# Altium schematic sheet power_supply.SchDoc
size A
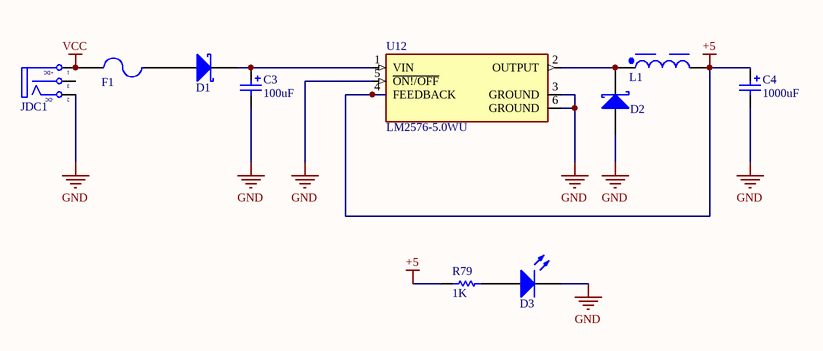
[diagram p0: power_supply.SchDoc]

## Parts
C3  100uF  [WCAP-ATG8_D8H11.5]
C4  1000uF  [WCAP-ATG8_D8H16]
D1  D Schottky  [SS34]  (value not drawn)
D2  D Schottky  [SS34]  (value not drawn)
D3  LED SMD  [LED_0603_Blue]  (value not drawn)
F1  Fuse  [FUSE SMD]  (value not drawn)
JDC1  Jack DC  [DC-IN]  (value not drawn)
L1  100µH, 0.57A  [WE-PD2_5848]  (value not drawn)
R79  value 1K  [RES-SM-0603]  (hidden comment: RESISTOR SMD)
U12  LM2576-5.0WU  [DPAK6P170_1524X459L254X81N]

## Nets
+5: C4.1(P) L1.2 R79.1 U12.4(FEEDBACK)
GND: C3.2(N) C4.2(N) D2.1(A) D3.2(K) JDC1.2(TN) U12.3(GROUND) U12.5(~{ON!/OFF}) U12.6(GROUND)
VCC: F1.1 JDC1.1(T)
NetC3_1: C3.1(P) D1.2(K) U12.1(VIN)
NetD1_1: D1.1(A) F1.2
NetD2_2: D2.2(K) L1.1 U12.2(OUTPUT)
NetD3_1: D3.1(A) R79.2

Not connected (* = marked no-connect by the designer): JDC1 3(S)

## Notes on the sheet
- (in symbol Jack DC) +DC; -DC

## Library data of the parts
C3 = 860010674014: WCAP-ATG8 Aluminum Electrolytic Capacitor, Radial THT, D8xH11.5mm, 100uF, 50V; Manufacturer: Wurth Elektronik; Capacitance Tolerance: +/-20%; Dissipation Factor: 10%; Endurance: 2000h; Leakage Current: 50uA; Ripple Current: 286mA; Technical Reference: ATBE115101M050DSPA7B000; ComponentLink1Description: Manufacturer Link; ComponentLink1URL: https://www.we-online.com/redexpert/article/860010674014?ad; ComponentLink2Description: Datasheet; ComponentLink2URL: https://www.we-online.com/redexpert/spec/860010674014?ad; Category: Aluminum Electrolytic Capacitors; Match Code: WCAP-ATG8; Manufacturer Part Number: 860010674014; Mount: Through Hole; Operating Temperature Max: 85°C; Operating Temperature Min: -40°C; Packaging: Ammo Pack; Height: 11.5mm; Diameter: 8mm; Capacitance: 100uF; Rated Voltage (DC): 50V
C4 = 860010274015: WCAP-ATG8 Aluminum Electrolytic Capacitor, Radial THT, D8xH16mm, 1000uF, 10V; Manufacturer: Wurth Elektronik; Capacitance Tolerance: +/-20%; Dissipation Factor: 19%; Endurance: 2000h; Leakage Current: 100uA; Ripple Current: 725mA; Technical Reference: ATBE160102M010DSPA7B000; ComponentLink1Description: Manufacturer Link; ComponentLink1URL: https://www.we-online.com/redexpert/article/860010274015?ad; ComponentLink2Description: Datasheet; ComponentLink2URL: https://www.we-online.com/redexpert/spec/860010274015?ad; Category: Aluminum Electrolytic Capacitors; Match Code: WCAP-ATG8; Manufacturer Part Number: 860010274015; Mount: Through Hole; Operating Temperature Max: 85°C; Operating Temperature Min: -40°C; Packaging: Ammo Pack; Height: 16mm; Diameter: 8mm; Capacitance: 1000uF; Rated Voltage (DC): 10V
D1 D2 = D Schottky: Schottky Diode; Published: 8-Jun-2000; LatestRevisionDate: 17-Jul-2002; LatestRevisionNote: Re-released for DXP Platform.; PackageReference: SMB; Publisher: Altium Limited; PackageDescription: DO-214-AA/SMB; 2 C-Bend Leads; Body 5.3 x 3.6 mm, inc. leads (LxW); Code_JEDEC: DO-214-AA
D3 = LED SMD: LED
JDC1 = Jack DC: Jack DC input; Value: Jac DC
L1 = 74477420: WE-PD2 SMT Power Inductor, 5848, 100µH, 0.57A, 0.65Ω; Manufacturer: Wurth Elektronik; Case/Size Code: 5848; DC Resistance: 0.51Ω; Saturation Current: 0.68A; Self Resonant Frequency: 7.5MHz; ComponentLink1Description: Website Link; ComponentLink1URL: https://www.we-online.com/redexpert/article/74477420?ad; ComponentLink2Description: Datasheet Link; ComponentLink2URL: https://www.we-online.com/redexpert/spec/74477420?ad; Manufacturer Part Number: 74477420; Category: Unshielded Power Inductors; Match Code: WE-PD2; Mount: Surface Mount; Operating Temperature Max: 125°C; Operating Temperature Min: -40°C; Packaging: Tape and Reel; Length: 5.8mm; Width: 5.2mm; Height: 4.5mm; DC Resistance Max: 0.65Ω; Inductance: 100µH; Rated Current: 0.57A
R79 = RESISTOR SMD: Resistor
U12 = LM2576-5.0WU: Buck Switching Regulator IC Positive Fixed 5V 1 Output 3A TO-263-6, DÂ²Pak _5 Leads + Tab_, TO-263BA; MF: Microchip; Value: *; MP: LM2576-5.0WU; SnapEDA_Link: https://www.snapeda.com/parts/LM2576-5.0WU/Microchip/view-part/104848/?ref=snap; Availability: Unavailable; Package: TO-263-5 Micrel; Price: None